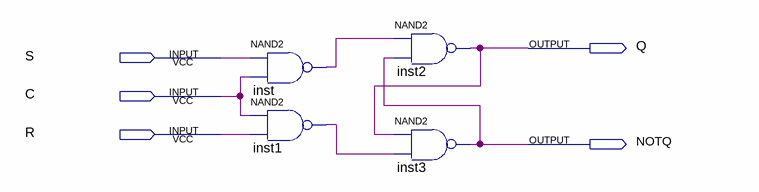
[diagram p0: schematic sheet]
// Quartus schematic ClockedSRlatch.bdf as structural Verilog: 4 symbols, 5 pins
module ClockedSRlatch (
  input  S,
  input  C,
  input  R,
  output Q,
  output NOTQ
);

  wire inst1_out, inst_out;

  nand inst (inst_out, S, C);
  nand inst1 (inst1_out, C, R);
  nand inst2 (Q, inst_out, NOTQ);
  nand inst3 (NOTQ, Q, inst1_out);
endmodule
